# EAGLE design esp8266_wio7c_breakout (EAGLE 6.5.0)
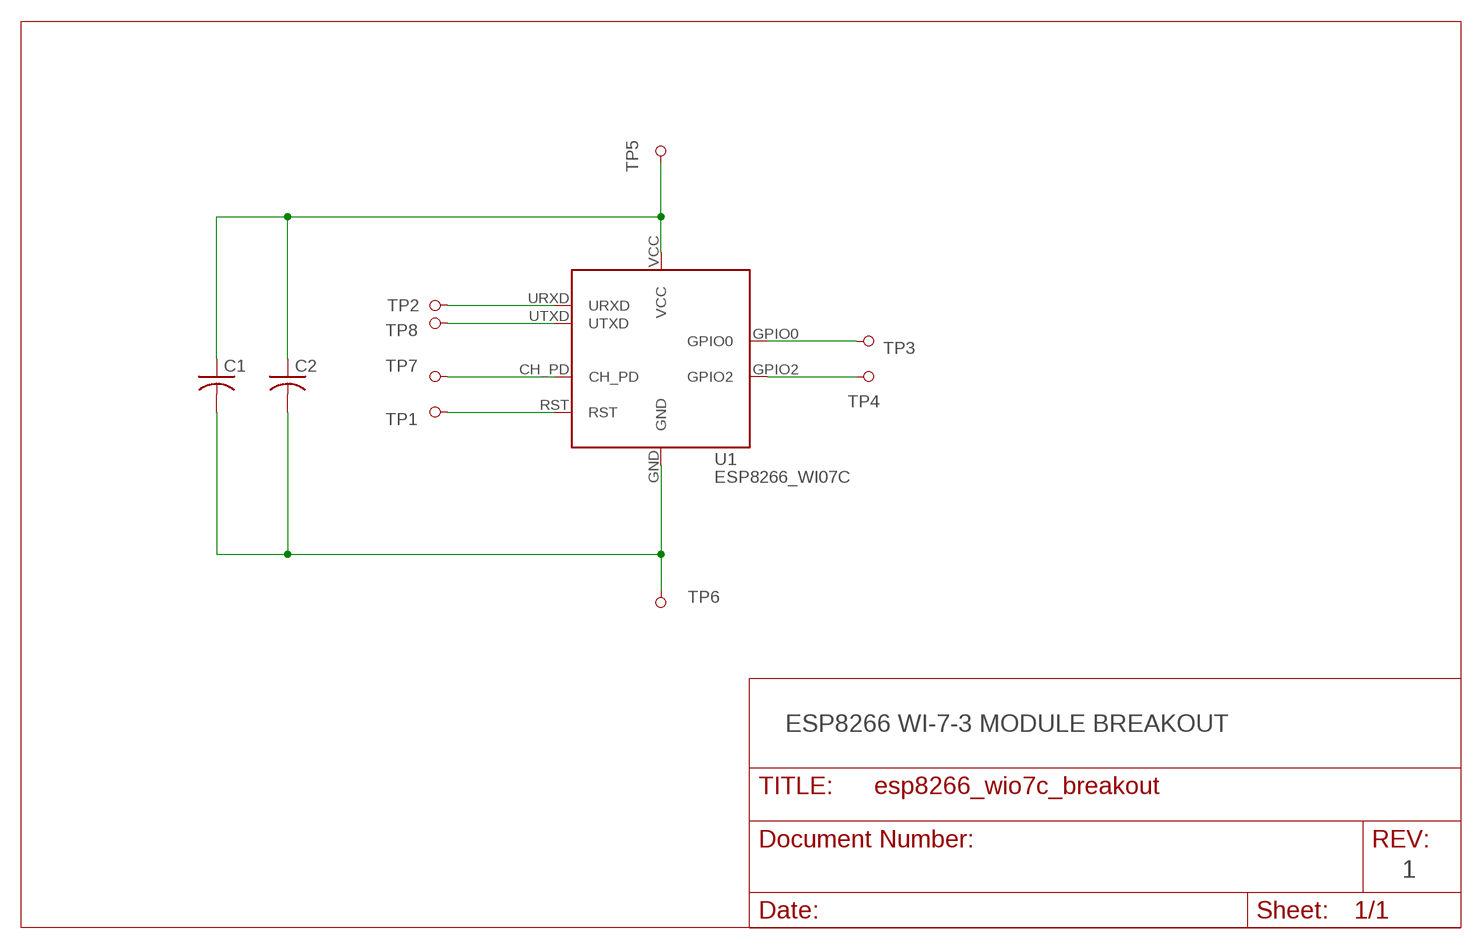
[diagram p0: schematic, sheet 1]

## Parts
C1  CAPACITORC0603K  [C0603K]
C2  CAPACITORC0603K  [C0603K]
TP1  PINHD-1X1  [1X01]
TP2  PINHD-1X1  [1X01]
TP3  PINHD-1X1  [1X01]
TP4  PINHD-1X1  [1X01]
TP5  PINHD-1X1  [1X01]
TP6  PINHD-1X1-FIRST  [1X01_FIRST]
TP7  PINHD-1X1  [1X01]
TP8  PINHD-1X1  [1X01]
U1  ESP8266_WI07C  [ESP8266_WI07C]

## Nets
CH_PD: TP7.1 U1.CH_PD
GND: C1.2 C2.2 TP6.1 U1.GND
GPIO0: TP3.1 U1.GPIO0
GPIO2: TP4.1 U1.GPIO2
RST: TP1.1 U1.RST
URXD: TP2.1 U1.URXD
UTXD: TP8.1 U1.UTXD
VCC: C1.1 C2.1 TP5.1 U1.VCC

## Notes on the sheet
- ESP8266 WI-7-3 MODULE BREAKOUT
- 1

## Library data of the parts
C1 C2 = arm-pro-mini:CAPACITOR: CAPACITOR, American symbol
TP1-TP5 TP7 TP8 = ltc2943_breakout:PINHD-1X1: PIN HEADER
TP6 = esp8266_wio73_breakout:PINHD-1X1-FIRST
U1 = esp8266_wio7c_breakout:ESP8266_WI07C

## Net classes
1 power: width 0.254 mm

## Board
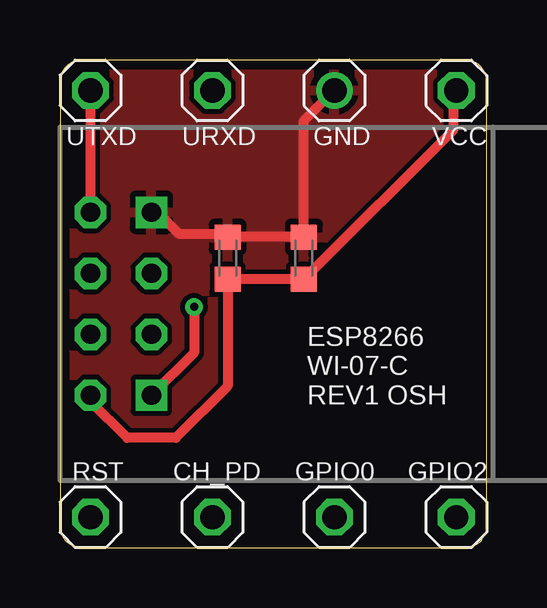
[diagram p1: board, top side]
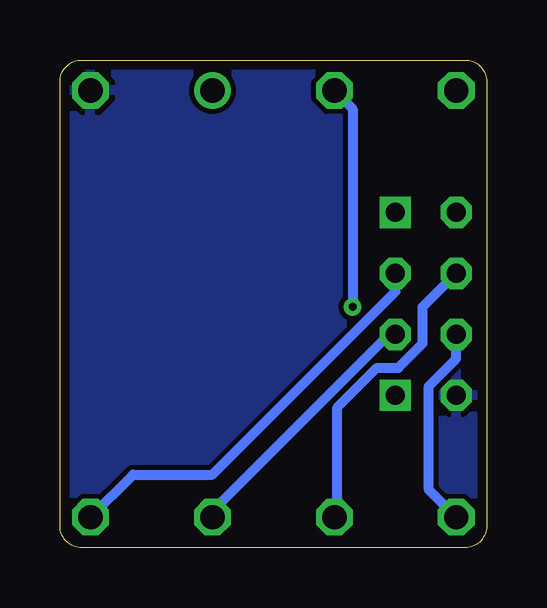
[diagram p2: board, bottom side, seen from below]

Size 17.78 x 20.32 mm. Coordinates in mm from the lower left corner, seen from the top.
Outline: 0,19.42 0,0.9 arc90 0.9,0 16.88,0 arc90 17.78,0.9 17.78,19.42 arc90 16.88,20.32 0.9,20.32 arc90 0,19.42
Copper layers (1*16): Top 0.035mm / dielectric 1.5mm / Bottom 0.035mm
Design rules "default *": minimum track width 16mil, minimum drill 13mil, track to track 8mil, track to pad 8mil, pad to pad 8mil, via to via 8mil, smd to smd 8mil, copper to edge 15mil, drill to drill 8mil, minimum pad ring 10mil, minimum via ring 8mil, stop-mask expansion 4mil, vias tented up to drill 20mil, thermal gap 10mil

### Footprints (pad centres in the part's own frame; a part is rotated, then mirrored left to right if it is on the bottom)
C0603K = smd 1.05 x 1.08: 1 -0.875,0; 2 0.875,0
1X01 = drill 1.016 octagon: 1 0,0
1X01_FIRST = drill 1.016: 1 0,0
ESP8266_WI07C = drill 0.8 octagon: CH_PD 1.27,6.35; GPIO0 3.81,3.81; GPIO2 3.81,6.35; RST 1.27,3.81; UTXD 1.27,8.89; VCC 1.27,1.27 | drill 0.8 square: GND 3.81,8.89; URXD 3.81,1.27

### Placement (x,y rotation side)
C1  10.16,12.07 90 top
C2  6.99,12.07 90 top
TP1  1.27,1.27 0 top
TP2  6.35,19.05 0 top
TP3  11.43,1.27 0 top
TP4  16.51,1.27 0 top
TP5  16.51,19.05 0 top
TP6  11.43,19.05 0 top
TP7  6.35,1.27 0 top
TP8  1.27,19.05 0 top
U1  0,5.08 0 top

### Tracks (layer width: path | path; a pad name or v marks a point on that pad's centre or on a via)
CH_PD
  Bottom 0.406: U1.CH_PD 2.67,10.03 2.67,8.51 3.68,7.49 4.57,7.49 6.22,5.84 6.22,1.4 TP7.1
GND
  Top 0.406: U1.GND 4.06,13.97 4.95,13.08 6.86,13.08 C2.2 6.99,12.95 10.16,12.95 C1.2 10.16,17.78 TP6.1
  pour Top: 0,0 0,20.32 17.78,20.32 17.78,0
GPIO0
  Bottom 0.406: U1.GPIO0 4.06,8.89 11.43,1.52 TP3.1
GPIO2
  Bottom 0.406: U1.GPIO2 3.81,10.67 11.43,3.05 14.73,3.05 TP4.1
RST
  Bottom 0.406: U1.RST 1.27,7.87 2.41,6.73 2.41,2.41 TP1.1
URXD  (via drill 0.33)
  Top 0.406: U1.URXD 5.59,8.13 v5.59,10.03
  Bottom 0.406: v5.59,10.03 5.59,18.29 TP2.1
UTXD
  Top 0.406: TP8.1 U1.UTXD
VCC
  Top 0.406: TP5.1 16.38,18.92 16.38,17.4 10.29,11.3 C1.1 10.16,11.18 6.99,11.18 C2.1 6.99,6.73 4.83,4.57 2.79,4.57 1.27,6.1 U1.VCC
  pour Bottom: 0,0 0,20.32 17.78,20.32 17.78,0

### Text on the board
tPlace: UTXD | URXD | GND | VCC | ESP8266 / WI-07-C / REV1 OSH | RST | CH_PD | GPIO0 | GPIO2